# EAGLE design brick_i2c_proximity (EAGLE 7.4.0)
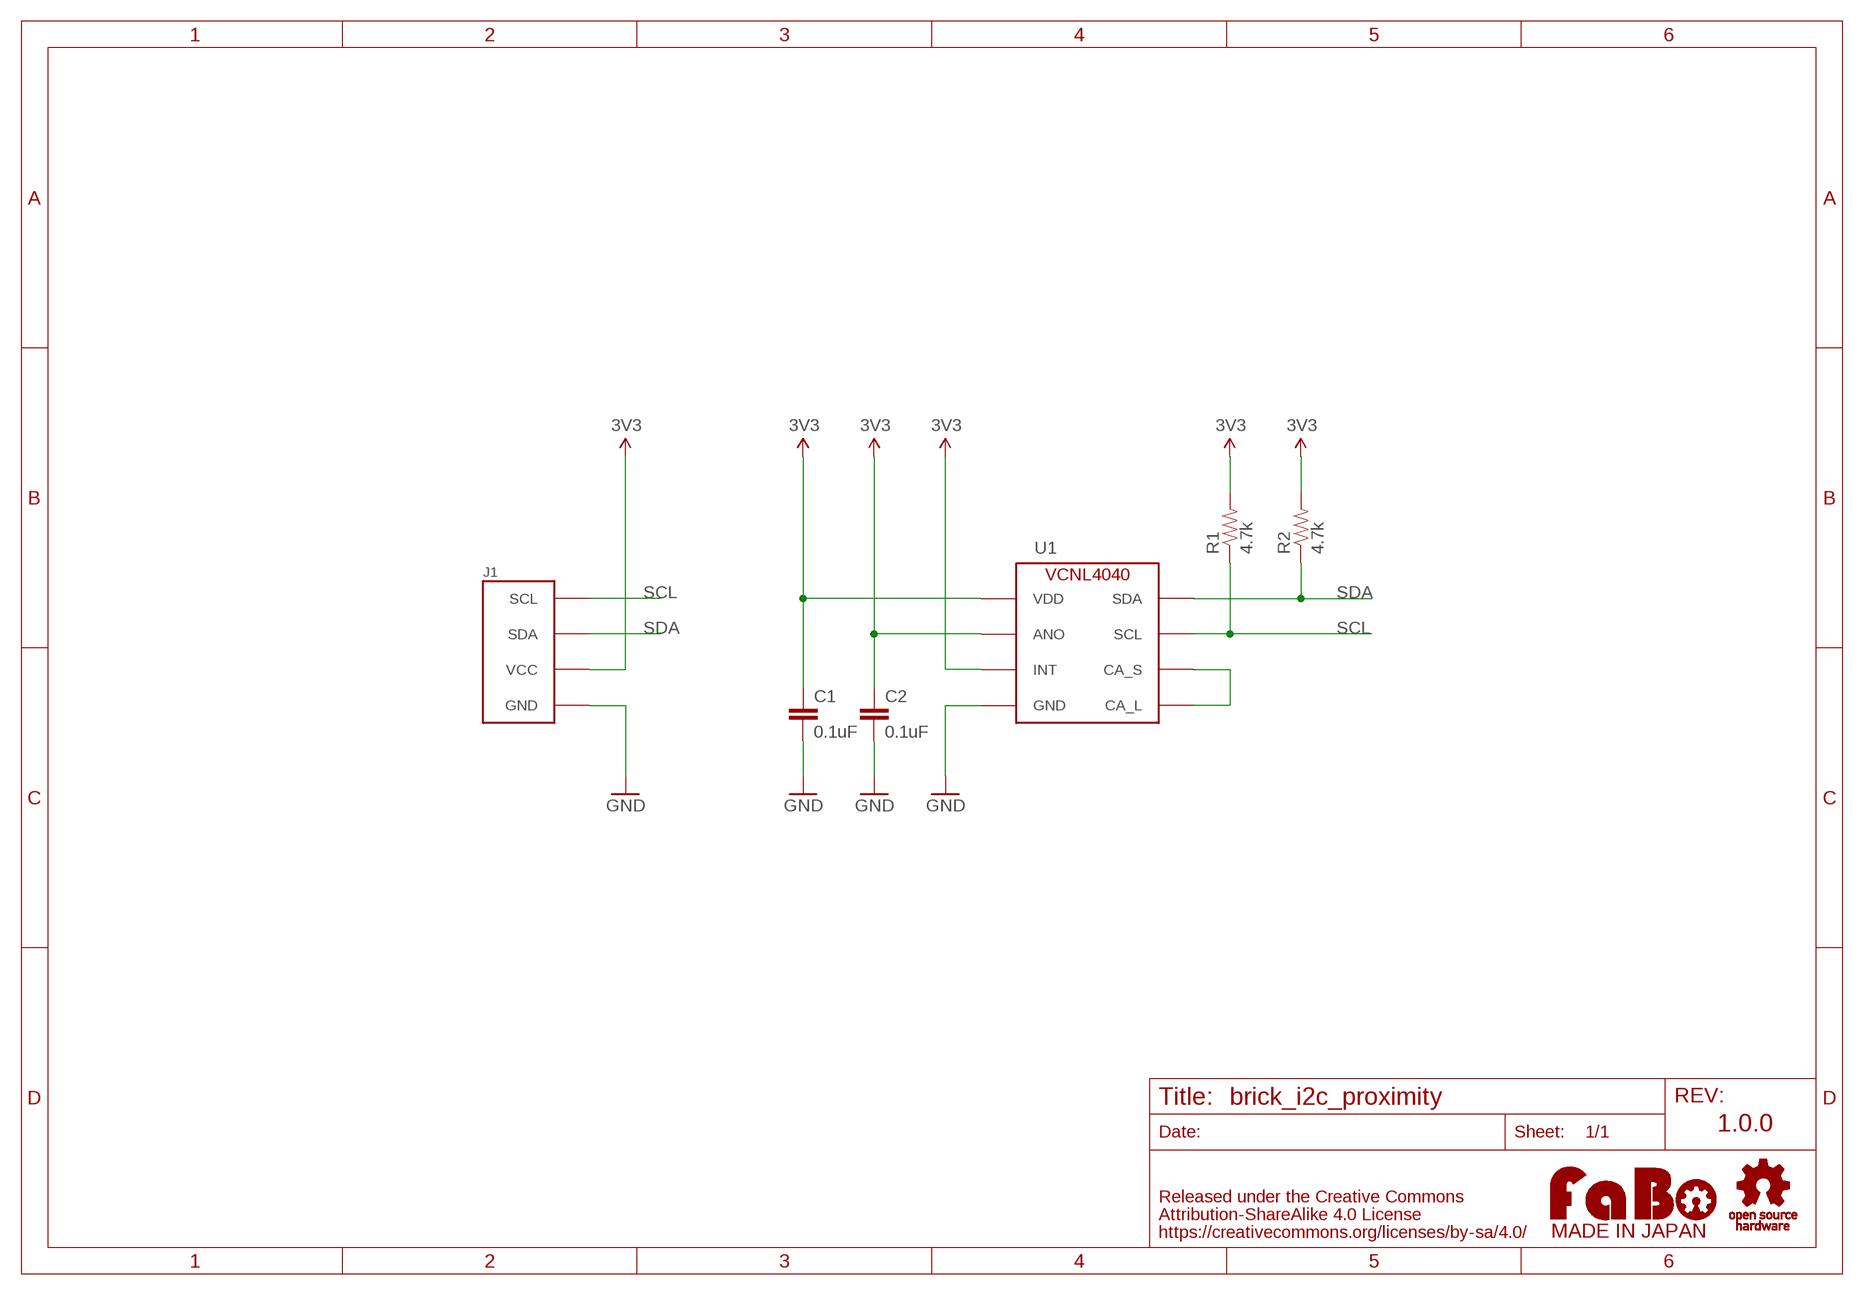
[diagram p0: schematic, sheet 1]

## Parts
C1  0.1uF  CAP-EIA0603  [EIA0603]
C2  0.1uF  CAP-EIA0603  [EIA0603]
J1  FABO_BRICK_I2C  [FABO_BRICK_I2C]
R1  4.7k  RES-EIA0603  [EIA0603]
R2  4.7k  RES-EIA0603  [EIA0603]
U1  VCNL4040M3OE  [VCNL4040M3OE]
U$2  LOGO_OSHW-T_M  [LOGO_OSHW_T_M]
U$3  LOGO_FABO-M  [LOGO_FABO_M]

## Nets
3V3: C1.1 C2.1 J1.VCC R1.2 R2.2 U1.3(VDD) U1.4(ANO) U1.6(INT)
GND: C1.2 C2.2 J1.GND U1.1(GND)
N$1: U1.2(CA_S) U1.5(CA_L)
SCL: J1.SCL R1.1 U1.8(SCL)
SDA: J1.SDA R2.1 U1.7(SDA)

## Notes on the sheet
- 1.0.0

## Library data of the parts
C1 C2 = FaBo-etc:CAP: Capacitor Standard 0603 ceramic capacitor
J1 = FaBo-Template:FABO_BRICK_I2C: FaBo Brick I2C
R1 R2 = FaBo-etc:RES
U1 = FaBo-Sensor:VCNL4040
U$2 = FaBo-etc:LOGO_OSHW
U$3 = FaBo-etc:LOGO_FABO

## Board
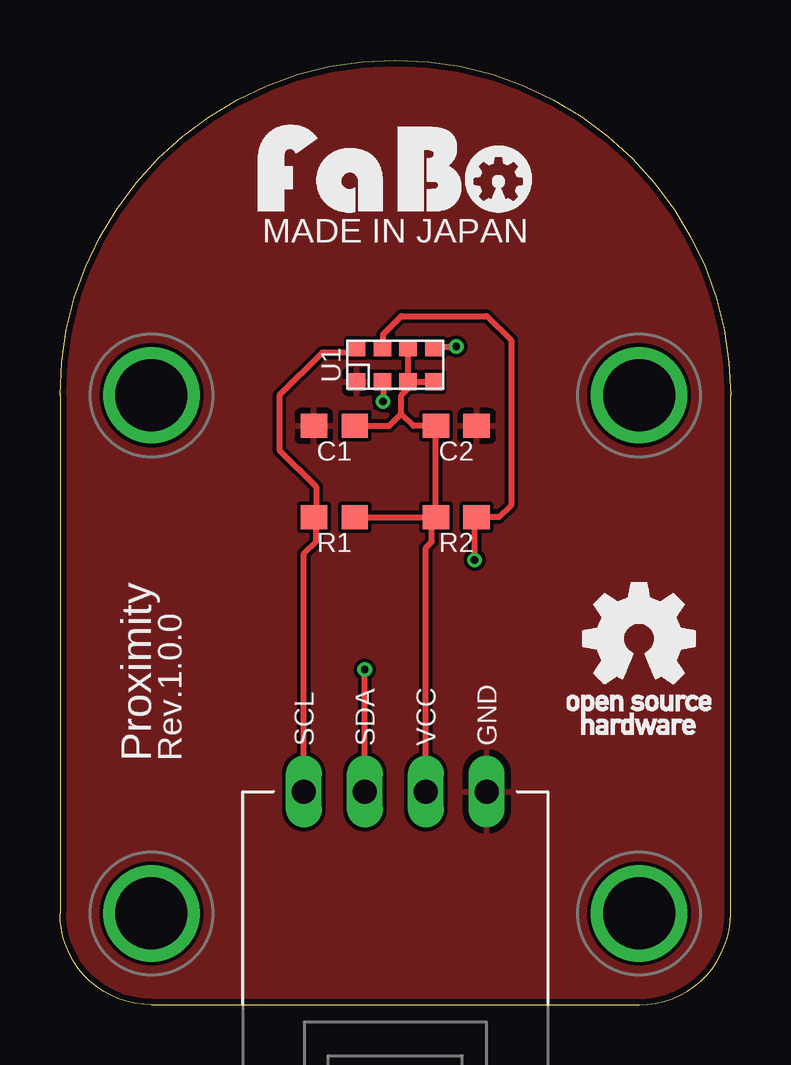
[diagram p1: board, top side]
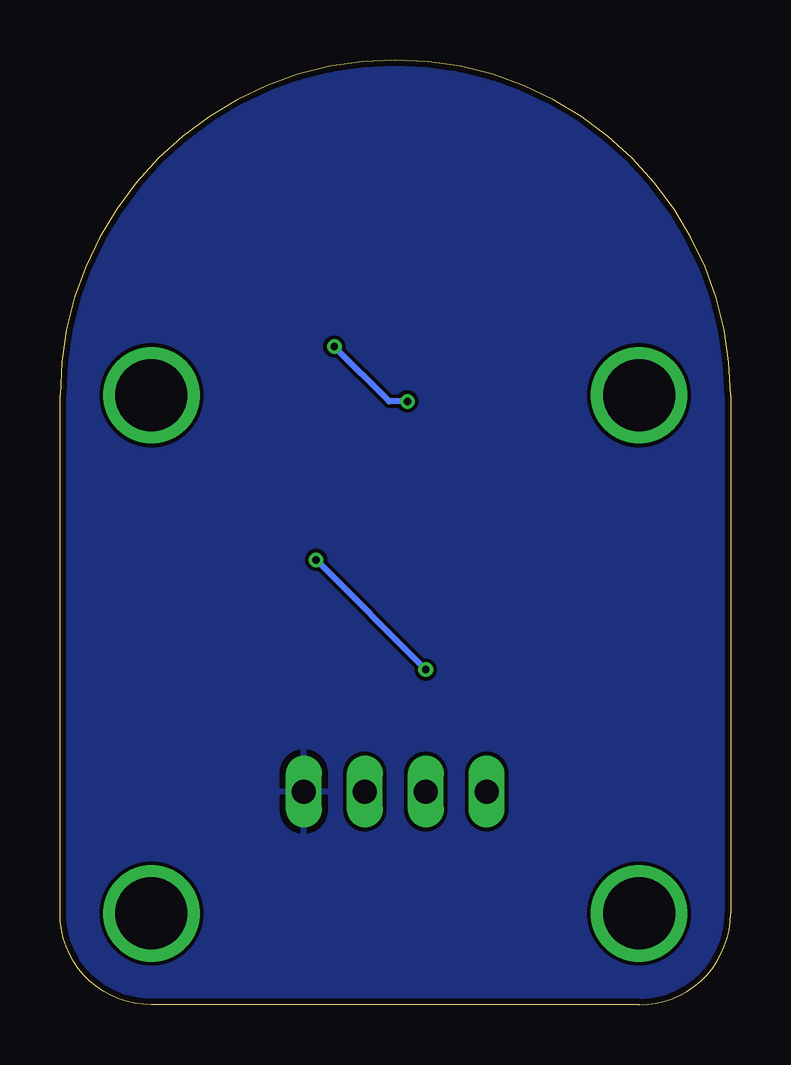
[diagram p2: board, bottom side, seen from below]

Size 27.94 x 39.37 mm. Coordinates in mm from the lower left corner, seen from the top.
Copper layers (1*16): Top 0.035mm / dielectric 1.5mm / Bottom 0.035mm
Design rules "Elecrow_2-layer_eagle_rule": minimum track width 6mil, minimum drill 12mil, track to track 6mil, track to pad 6mil, pad to pad 6mil, via to via 6mil, smd to smd 0mil, copper to edge 10mil, drill to drill 10mil, minimum pad ring 10mil, minimum via ring 6mil, stop-mask expansion 2mil, vias tented up to drill 100mil, thermal gap 10mil

### Footprints (pad centres in the part's own frame; a part is rotated, then mirrored left to right if it is on the bottom)
EIA0603 = smd 1.1 x 1: 1 -0.85,0; 2 0.85,0
FABO_BRICK_I2C = drill 1 long: GND 3.81,-10.16; SCL -3.81,-10.16; SDA -1.27,-10.16; VCC 1.27,-10.16 | drill 3 pad 3.81: P$1 -10.16,6.35; P$2 10.16,6.35; P$3 -10.16,-15.24; P$4 10.16,-15.24
VCNL4040M3OE = smd 0.7 x 0.725: 1 0.7,-1.613; 2 0.7,-0.537; 3 0.7,0.537; 4 0.7,1.613; 5 -0.7,1.613; 6 -0.7,0.537; 7 -0.7,-0.537; 8 -0.7,-1.613

### Placement (x,y rotation side)
C1  11.43,24.13 180 top
C2  16.51,24.13 0 top
J1  13.97,19.05 0 top
R1  11.43,20.32 0 top
R2  16.51,20.32 180 top
U1  13.97,26.67 270 top
U$2  24.13,15.24 0 top
U$3  13.97,33.02 0 top

### Tracks (layer width: path | path; a pad name or v marks a point on that pad's centre or on a via)
3V3
  Top 0.254: U1.3 U1.6 | U1.3 U1.4 | 14.22,24.64 14.73,24.13 C2.1 R2.2 | 14.22,24.64 14.22,25.4 14.48,25.65 14.48,25.94 U1.3 | C1.1 13.72,24.13 14.22,24.64 | R1.2 R2.2 | J1.VCC 15.24,19.05 15.49,19.3 15.49,20.15 R2.2
GND
  pour Bottom: -1.27,-1.27 29.21,-1.27 29.21,40.64 -1.27,40.64
  pour Top: -1.27,-1.27 29.21,-1.27 29.21,40.64 -1.27,40.64
N$1  (via drill 0.3)
  Top 0.254: U1.5 15.69,27.37 15.75,27.43 v16.51,27.43 | U1.2 13.43,25.94 13.46,25.91 v13.46,25.15
  Bottom 0.254: v13.46,25.15 14.22,25.15 v16.51,27.43
SCL
  Top 0.254: U1.8 12.36,27.34 12.19,27.18 10.92,27.18 9.14,25.4 9.14,23.11 10.67,21.59 10.67,20.41 R1.1 10.67,20.23 10.67,19.3 10.16,18.8 J1.SCL
SDA  (via drill 0.3)
  Top 0.254: U1.7 13.43,27.4 13.46,27.43 13.46,27.94 14.22,28.7 17.78,28.7 18.8,27.69 18.8,20.83 18.29,20.32 R2.1 17.27,20.23 v17.27,18.54 | J1.SDA v12.7,13.97
  Bottom 0.254: v12.7,13.97 v17.27,18.54

### Text on the board
tPlace: MADE IN JAPAN | Proximity | Rev.1.0.0